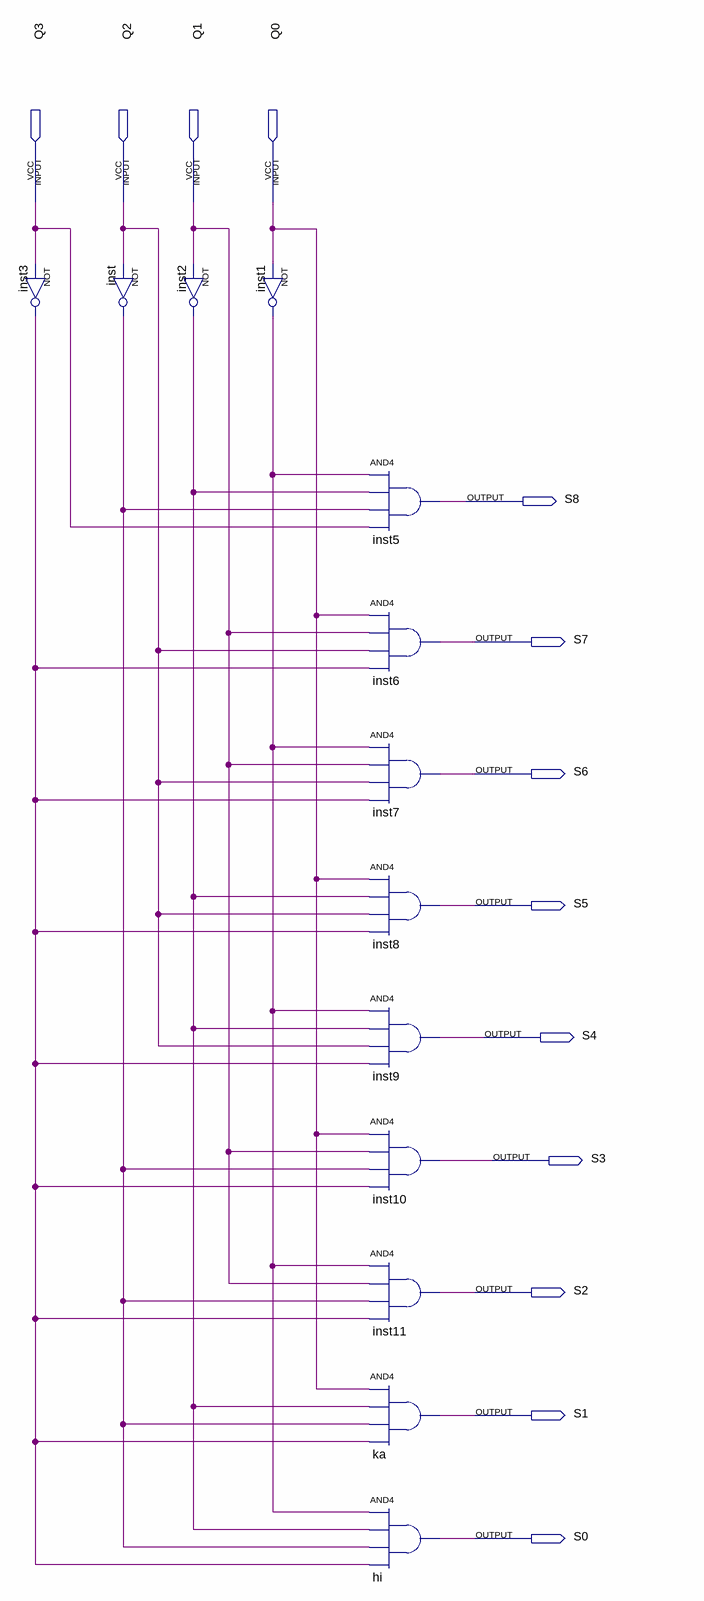
[diagram p0: schematic sheet]
// Quartus schematic Block2.bdf as structural Verilog: 13 symbols, 13 pins
module Block2 (
  input  Q3,
  input  Q2,
  input  Q1,
  input  Q0,
  output S8,
  output S7,
  output S6,
  output S5,
  output S4,
  output S3,
  output S2,
  output S1,
  output S0
);

  wire inst1_out, inst2_out, inst3_out, inst_out;

  not inst3 (inst3_out, Q3);
  not inst (inst_out, Q2);
  not inst2 (inst2_out, Q1);
  not inst1 (inst1_out, Q0);
  and inst5 (S8, inst1_out, inst2_out, inst_out, Q3);
  and inst6 (S7, Q0, Q1, Q2, inst3_out);
  and inst7 (S6, inst1_out, Q1, Q2, inst3_out);
  and inst8 (S5, Q0, inst2_out, Q2, inst3_out);
  and inst9 (S4, inst1_out, inst2_out, Q2, inst3_out);
  and inst10 (S3, Q0, Q1, inst_out, inst3_out);
  and inst11 (S2, inst1_out, Q1, inst_out, inst3_out);
  and ka (S1, Q0, inst2_out, inst_out, inst3_out);
  and hi (S0, inst1_out, inst2_out, inst_out, inst3_out);
endmodule
